# EAGLE schematic PV_power_board_0.1 (EAGLE 9.6.2)
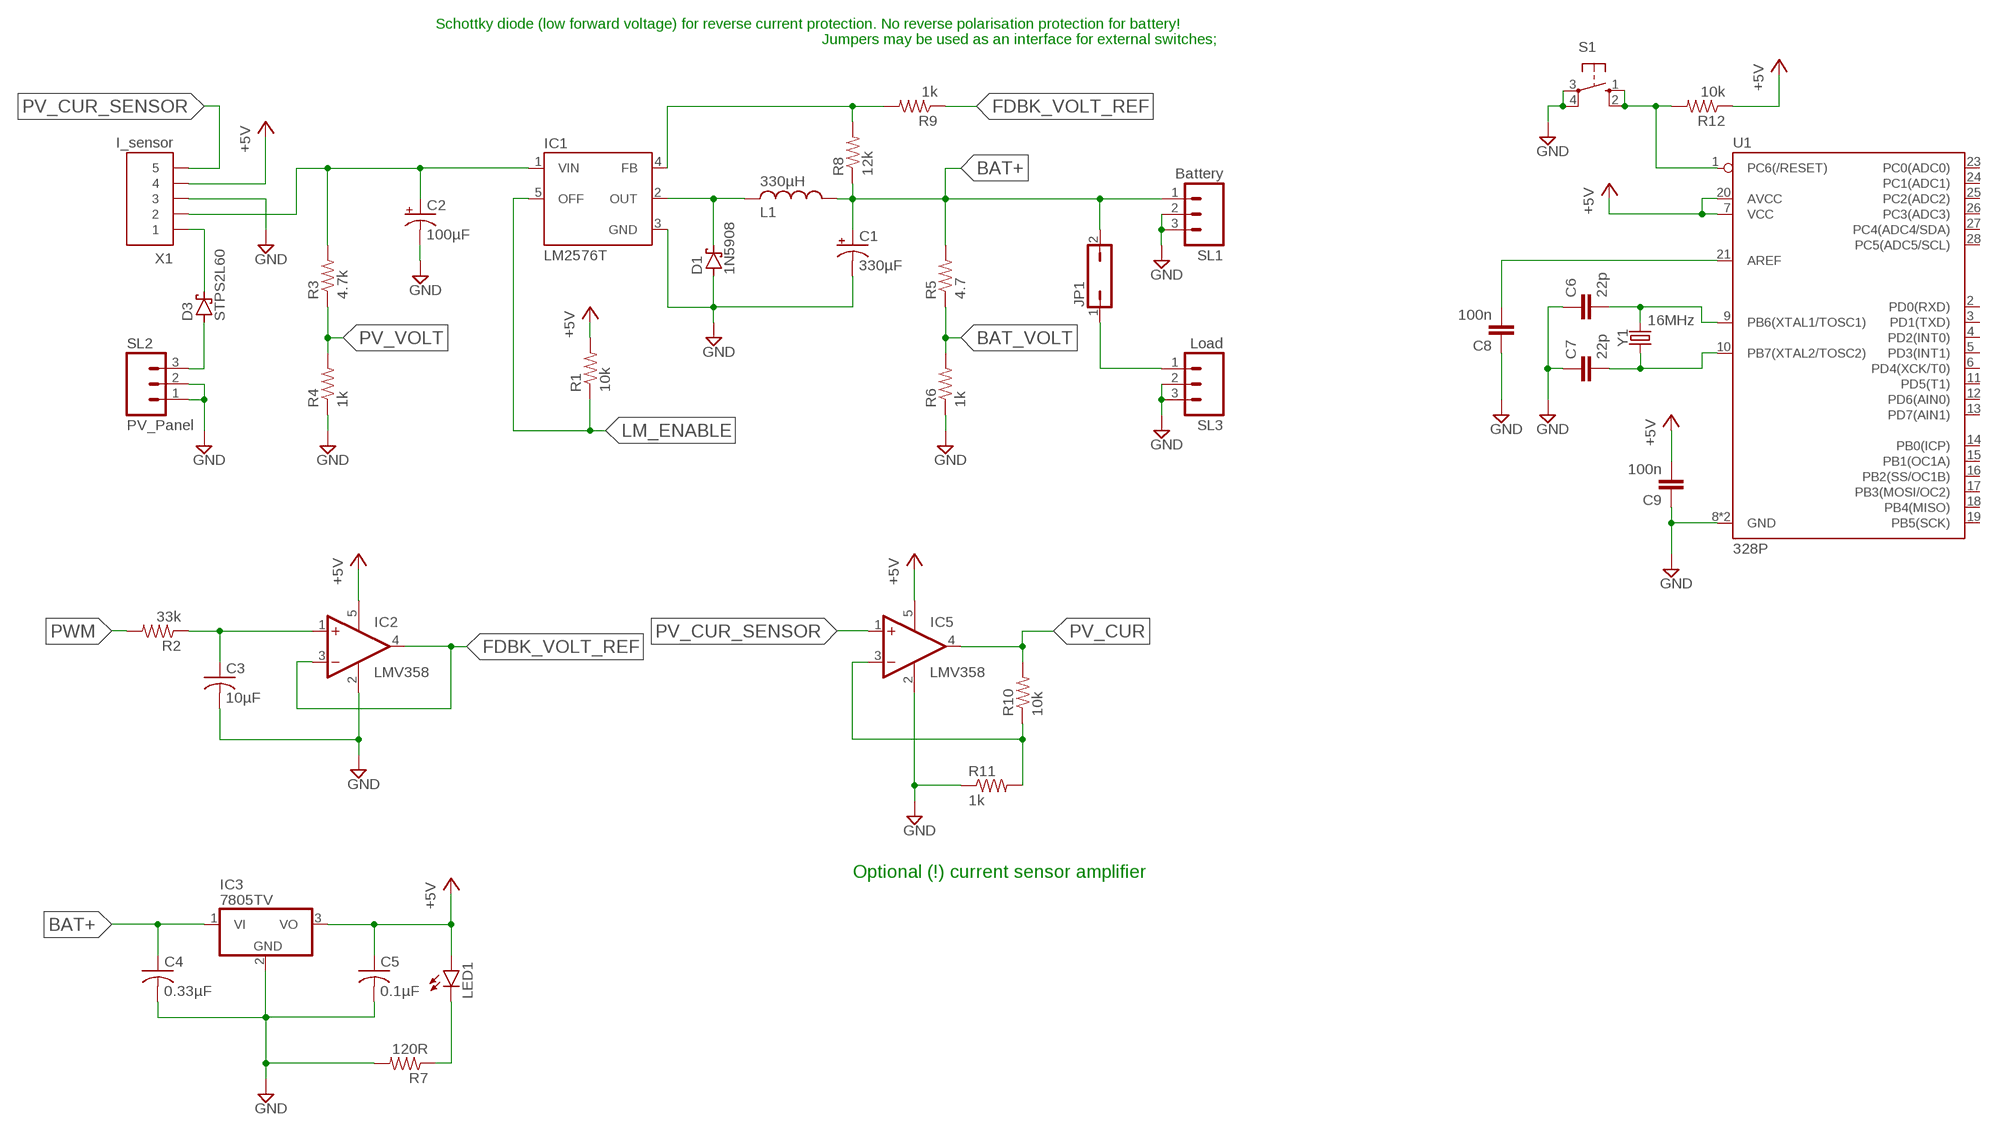
[diagram p0: schematic, sheet 1]

## Parts
C1  330µF  CPOL-USE3.5-8  [E3,5-8]
C2  100µF  CPOL-USE3.5-8  [E3,5-8]
C3  10µF  C-US025-025X050  [C025-025X050]
C4  0.33µF  C-US025-025X050  [C025-025X050]
C5  0.1µF  C-US025-025X050  [C025-025X050]
C6  22p  C2.5/2  [C2.5-2]
C7  22p  C2.5/2  [C2.5-2]
C8  100n  C2.5/2  [C2.5-2]
C9  100n  C2.5/2  [C2.5-2]
D1  1N5908  [C4111-15]
D3  STPS2L60  1N5908  [C4111-15]
IC1  LM2576T  [TO220-5]
IC2  LMV358  LMV321M5  [SOT23-5]
IC3  7805TV  [TO220V]
IC5  LMV358  LMV321M5  [SOT23-5]
JP1  JP1Q  [JP1]
L1  330µH  L-US6000-XXX-RC  [6000-XXXX-RC]
LED1  LED5MM  [LED5MM]
R1  10k  R-US_0207/10  [0207/10]
R2  33k  R-US_0207/10  [0207/10]
R3  4.7k  R-US_0207/10  [0207/10]
R4  1k  R-US_0207/10  [0207/10]
R5  4.7  R-US_0207/10  [0207/10]
R6  1k  R-US_0207/10  [0207/10]
R7  120R  R-US_0207/10  [0207/10]
R8  12k  R-US_0207/10  [0207/10]
R9  1k  R-US_0207/10  [0207/10]
R10  10k  R-US_0207/10  [0207/10]
R11  1k  R-US_0207/10  [0207/10]
R12  10k  R-US_0207/10  [0207/10]
S1  10-XX  [B3F-10XX]
SL1  Battery  M03  [03P]
SL2  PV_Panel  M03  [03P]
SL3  Load  M03  [03P]
U1  328P  ATMEGA328P_PDIP  [DIP28]
X1  I_sensor  MKS1855-6-0-505  [MKS1855-6-0-505]
Y1  16MHz  CRYSTAL-16MHZPTH-HC49US  [HC49US]

## Nets
+5V: C5.1 C9.2 IC2.5(V+) IC3.3(VO) IC5.5(V+) LED1.A R1.2 R12.1 U1.7(VCC) U1.20(AVCC) X1.4
BAT+: C1.+ C4.1 IC3.1(VI) JP1.2 L1.1 R5.2 R8.1 SL1.1
BAT_VOLT: R5.1 R6.2
FDBK_VOLT_REF: IC2.3(-IN) IC2.4(OUT) R9.1
GND: C1.- C2.- C3.2 C4.2 C5.2 C6.1 C7.1 C8.1 C9.1 D1.A IC1.3(GND) IC2.2(V-) IC3.2(GND) IC5.2(V-) R4.1 R6.1 R7.2 R11.1 S1.3(P) S1.4(P1) SL1.2 SL1.3 SL2.1 SL2.2 SL3.2 SL3.3 U1.8(GND) U1.22(GND) X1.3
LM_ENABLE: IC1.5(OFF) R1.1
LM_FEEDBACK: IC1.4(FB) R8.2 R9.2
LM_VIN: C2.+ IC1.1(VIN) R3.2 X1.2
N$1: D1.C IC1.2(OUT) L1.2
N$2: C3.1 IC2.1(+IN) R2.1
N$3: D3.C X1.1
N$4: LED1.K(C) R7.1
N$5: D3.A SL2.3
N$6: JP1.1 SL3.1
N$7: C6.2 U1.9(PB6(XTAL1/TOSC1)) Y1.2
N$8: IC5.3(-IN) R10.1 R11.2
N$9: C7.2 U1.10(PB7(XTAL2/TOSC2)) Y1.1
N$10: R12.2 S1.1(S) S1.2(S1) U1.1(PC6(/RESET))
N$13: C8.2 U1.21(AREF)
PV_CUR: IC5.4(OUT) R10.2
PV_CUR_SENSOR: IC5.1(+IN) X1.5
PV_VOLT: R3.1 R4.2
PWM: R2.2
Unconnected: U1.2(PD0(RXD)) U1.3(PD1(TXD)) U1.4(PD2(INT0)) U1.5(PD3(INT1)) U1.6(PD4(XCK/T0)) U1.11(PD5(T1)) U1.12(PD6(AIN0)) U1.13(PD7(AIN1)) U1.14(PB0(ICP)) U1.15(PB1(OC1A)) U1.16(PB2(SS/OC1B)) U1.17(PB3(MOSI/OC2)) U1.18(PB4(MISO)) U1.19(PB5(SCK)) U1.23(PC0(ADC0)) U1.24(PC1(ADC1)) U1.25(PC2(ADC2)) U1.26(PC3(ADC3)) U1.27(PC4(ADC4/SDA)) U1.28(PC5(ADC5/SCL))

## Notes on the sheet
- Schottky diode (low forward voltage) for reverse current protection. No reverse polarisation protection for battery!
- Jumpers may be used as an interface for external switches;
- Optional (!) current sensor amplifier

## Library data of the parts
C1 C2 = rcl:CPOL-US: POLARIZED CAPACITOR, American symbol; SPICEPREFIX: C
C3-C5 = rcl:C-US: CAPACITOR, American symbol; SPICEPREFIX: C
C6-C9 = capacitor-wima:C: CAPACITOR naming: grid - package width
D1 D3 = diode:1N5908: DIODE schottky
IC1 = LM2576_eagle_lib:LM2576: National Semiconductor <http://www.national.com> 3.0A "Simple Switcher"(c) 52kHz, Vout 1.23-37V (HV: 57V), Vin 40V (HV: 60V), 50µA standby current
IC2 IC5 = linear:LMV321?*: General Purpose, Low Voltage, Rail-to-Rail Output Operational Amplifiers Source: http://www.national.com/mpf/LM/LMV321.html http://www.national.com/dt/lmv_qual.pdf
IC3 = linear:78*: Positive VOLTAGE REGULATOR Source: http://cache.national.com/ds/LM/LM78L05.pdf http://www.fairchildsemi.com/ds/LM/LM7805.pdf
JP1 = jumper:JP1Q: JUMPER
L1 = rcl:L-US: INDUCTOR, American symbol; SPICEPREFIX: L
LED1 = led:LED: LED OSRAM: - CHIPLED LG R971, LG N971, LY N971, LG Q971, LY Q971, LO R971, LY R971 LH N974, LH R974 LS Q976, LO Q976, LY Q976 LO Q996 - Hyper CHIPLED LW Q18S LB Q993, LB Q99A, LB R99A - SideLED LS A670, LO A670, LY A670, LG A670, LP A670 LB A673, LV A673, LT A673, LW A673 LH A674 LY A675 LS A676, LA A676, LO A676, LY A676, LW A676 LS A679, LY A679, LG A679 - Hyper Micro SIDELED® LS Y876, LA Y876, LO Y876, LY Y876 LT Y87S - SmartLED LW L88C, LW L88S LB L89C, LB L89S, LG L890 LS L89K, LO L89K, LY L89K LS L896, LA L896, LO L896, LY L896 - TOPLED LS T670, LO T670, LY T670, LG T670, LP T670 LSG T670, LSP T670, LSY T670, LOP T670, LYG T670 LG T671, LOG T671, LSG T671 LB T673, LV T673, LT T673, LW T673 LH T674 LS T676, LA T676, LO T676, LY T676, LB T676, LH T676, LSB T676, LW T676 LB T67C, LV T67C, LT T67C, LS T67K, LO T67K, LY T67K, LW E67C LS E67B, LA E67B, LO E67B, LY E67B, LB E67C, LV E67C, LT E67C LW T67C LS T679, LY T679, LG T679 LS T770, LO T770, LY T770, LG T770, LP T770 LB T773, LV T773, LT T773, LW T773 LH T774 LS E675, LA E675, LY E675, LS T675 LS T776, LA T776, LO T776, LY T776, LB T776 LHGB T686 LT T68C, LB T68C - Hyper Mini TOPLED® LB M676 - Mini TOPLED Santana® LG M470 LS M47K, LO M47K, LY M47K Source: http://www.osram.convergy.de LUXEON: - LUMILED® LXK2-PW12-R00, LXK2-PW12-S00, LXK2-PW14-U00, LXK2-PW14-V00 LXK2-PM12-R00, LXK2-PM12-S00, LXK2-PM14-U00 LXK2-PE12-Q00, LXK2-PE12-R00, LXK2-PE12-S00, LXK2-PE14-T00, LXK2-PE14-U00 LXK2-PB12-K00, LXK2-PB12-L00, LXK2-PB12-M00, LXK2-PB14-N00, LXK2-PB14-P00, LXK2-PB14-Q00 LXK2-PR12-L00, LXK2-PR12-M00, LXK2-PR14-Q00, LXK2-PR14-R00 LXK2-PD12-Q00, LXK2-PD12-R00, LXK2-PD12-S00 LXK2-PH12-R00, LXK2-PH12-S00 LXK2-PL12-P00, LXK2-PL12-Q00, LXK2-PL12-R00 Source: www.luxeon.com KINGBRIGHT: KA-3528ASYC Source: www.kingbright.com
R1-R12 = rcl:R-US_: RESISTOR, American symbol; SPICEPREFIX: R
S1 = switch-omron:10-XX: OMRON SWITCH; MPN: B3F-1000; OC_FARNELL: 176432; OC_NEWARK: 36M3542
SL1-SL3 = con-amp-quick:M03: AMP QUICK CONNECTOR; OC_FARNELL: unknown; OC_NEWARK: unknown
U1 = SparkFun-IC-Microcontroller:ATMEGA328P_PDIP: Atmel 328P Through hole ATMEGA328P uC used in the Arduino 32kb flash, 1k EEPROM, 2k SRAM Datasheet <http://www.sparkfun.com/datasheets/Components/SMD/ATMega328.pdf> SparkFun Products Storefront component: AVR 28 Pin 20MHz 32K 6A/D - ATMega328P <https://www.sparkfun.com/products/9061> (COM-09061) SparkFun Simon Says - Through-Hole Soldering Kit <https://www.sparkfun.com/products/10547> (KIT-10547) SparkFun Learn to Solder - Simon Says <https://www.sparkfun.com/products/13708> (KIT-13708) SparkFun BigTime Watch Kit <https://www.sparkfun.com/products/11734> (KIT-11734) SparkFun ClockIt <https://www.sparkfun.com/products/10930> (KIT-10930) SparkFun Serial Enabled LCD Kit <https://www.sparkfun.com/products/10097> (LCD-10097) SparkFun Simon Tilts - Through Hole Soldering Kit <https://www.sparkfun.com/products/12634> (KIT-12634) SparkFun Frequency Counter Kit <https://www.sparkfun.com/products/10140> (KIT-10140) FabFM Radio Kit <https://www.sparkfun.com/products/11043> (KIT-11043) SparkFun Binary Blaster Kit <https://www.sparkfun.com/products/12037> (KIT-12037) SparkFun Metro-Gnome <https://www.sparkfun.com/products/9236> (KIT-09236) ATmega328 with Arduino Optiboot (Uno) <https://www.sparkfun.com/products/10524> (DEV-10524); PROD_ID: IC-09136
X1 = con-stocko:MKS1855-6-0-505: Serie MKS 1850 Lötstifte In-line, Raster 2.5 mm, Stiftwannen, stehend, mit Rastlasche Source: http://www.stocko.de/de/index.php?seite=ka_rfk2_mks1850.html&rubrik=Katalog+-+RFK+2 rfk_1850.pdf; OC_FARNELL: 1134508; OC_NEWARK: unknown
Y1 = SparkFun-Clocks:CRYSTAL-16MHZ: 16MHz Crystal Digikey Example <http://www.digikey.com/product-search/en?keywords=535-9122-1-ND> Frequency: 16MHz Frequency Stability: ±50ppm Frequency Tolerance: ±20ppm Load Capacitance: 18pF SparkFun Products: Pro Micro -5V/16MHz <https://www.sparkfun.com/products/12640> SparkFun Serial Enabled LCD Kit <https://www.sparkfun.com/products/10097>; PROD_ID: XTAL-08181; SF_ID: COM-00536